# Altium project HighCurrent-Probe.PrjPcb
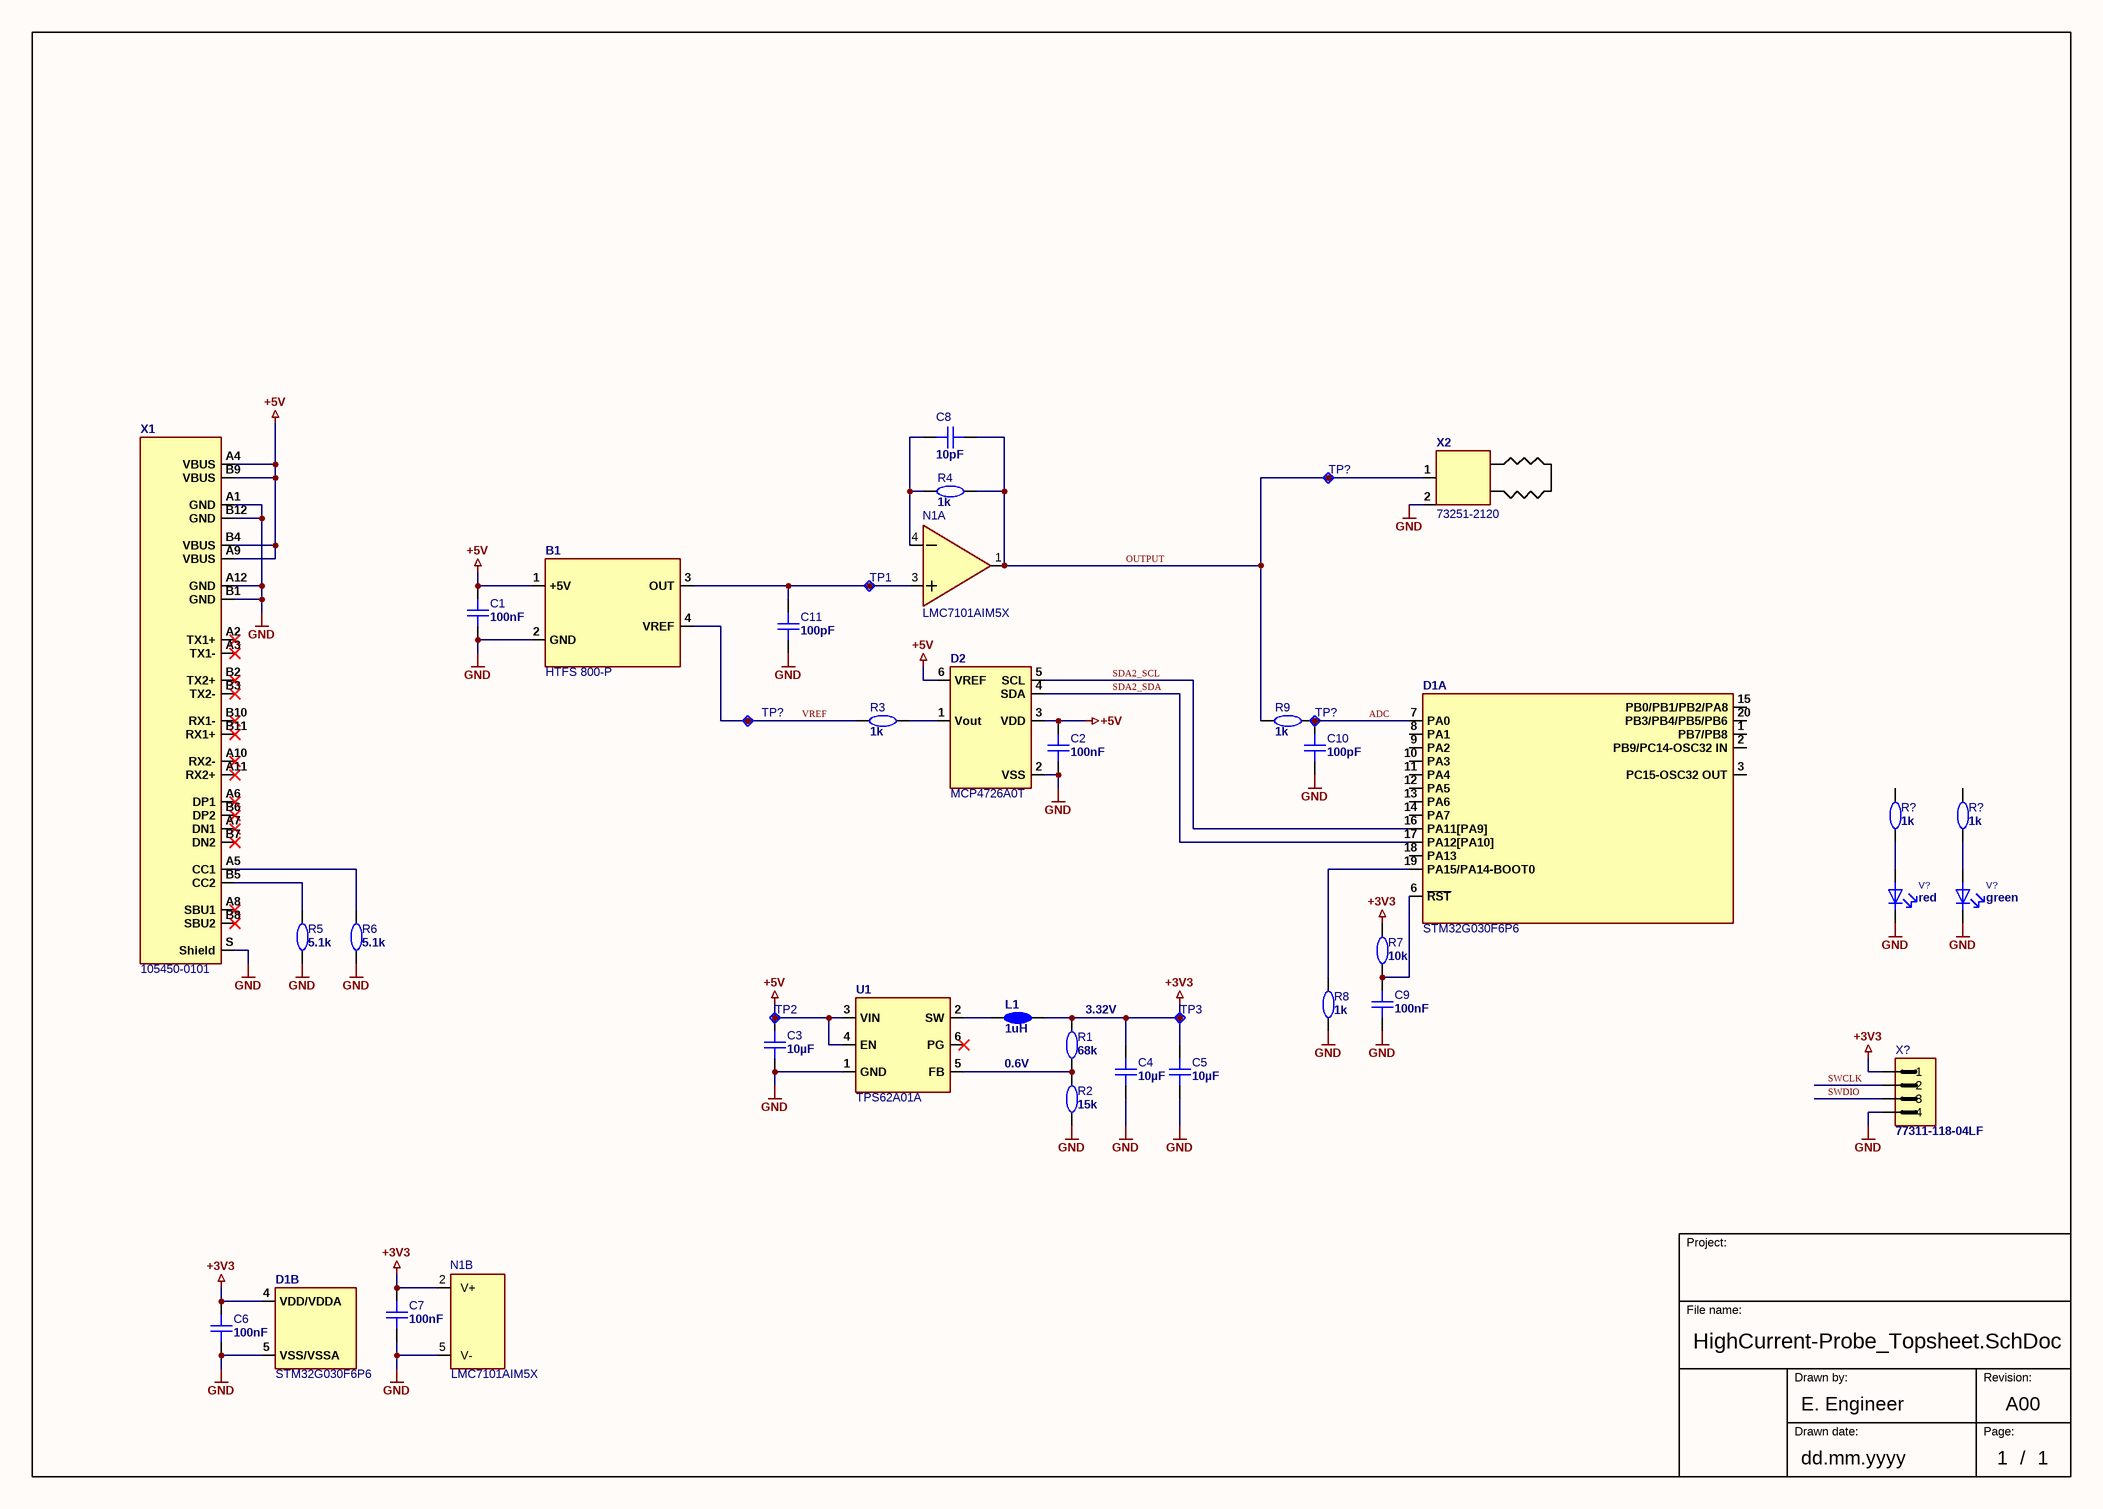
[diagram p0: HighCurrent-Probe_Topsheet.SchDoc]
PCB_Assy_DrawnBy: A. P. Assy; PCB_Assy_DrawnDate: dd.mm.yyyy; PCB_CheckedBy: C. PCB Checker; PCB_CheckedDate: dd.mm.yyyy; PCB_DrawnBy: D. Designer; PCB_DrawnDate: dd.mm.yyyy; PCB_PartNo: XXX.XXXX; PCB_PartNo: XXX.XXXX; PCB_Revision: A; PCB_Title: PCB_Title; PCB_Title: PCB_Title; PCB_TP_DocumentNo: XXXXXXXX; PCB_TP_Revision: A; Revision: A00; Schematic_CheckedBy: C. Sch Checker; Schematic_CheckedBy: C. Sch Checker; Schematic_CheckedDate: dd.mm.yyyy; Schematic_CheckedDate: dd.mm.yyyy; Schematic_DocumentNo: XXXXXXXX; Schematic_DrawnBy: E. Engineer; Schematic_DrawnBy: E. Engineer; Schematic_DrawnDate: dd.mm.yyyy; Schematic_DrawnDate: dd.mm.yyyy; Schematic_Revision: A00; Schematic_Title: SchematicTitle; Schematic_Title: SchematicTitle
1 sheet, 39 parts. Net scope: global (net labels, ports and power ports of the same name join across sheets).
Board file: HighCurrent-Probe.PcbDoc

## Sheet HighCurrent-Probe_Topsheet.SchDoc
size A3; SheetNumber: 1; SheetTotal: 1

### Parts
(Parts that share a designator on the sheet are numbered #1, #2 ... from top to bottom, then left to right.)
B1  HTFS 800-P  [HTFS 800-P]
C1  value 100nF  [C-0603_1608_095_L_RF]  (hidden comment: Cap 100n 0603)
C2  value 100nF  [C-0603_1608_095_L_RF]  (hidden comment: Cap 100n 0603)
C3  value 10µF  [C-0805_2012_155_L_RF]  (hidden comment: Cap 10u 0805)
C4  value 10µF  [C-0805_2012_155_L_RF]  (hidden comment: Cap 10u 0805)
C5  value 10µF  [C-0805_2012_155_L_RF]  (hidden comment: Cap 10u 0805)
C6  value 100nF  [C-0603_1608_095_L_RF]  (hidden comment: Cap 100n 0603)
C7  value 100nF  [C-0603_1608_095_L_RF]  (hidden comment: Cap 100n 0603)
C8  value 10pF  [C-0603_1608_095_L_RF]  (hidden comment: Cap 10p 0603)
C9  value 100nF  [C-0603_1608_095_L_RF]  (hidden comment: Cap 100n 0603)
C10  value 100pF  [C-0603_1608_095_L_RF]  (hidden comment: Cap 100p 0603)
C11  value 100pF  [C-0603_1608_095_L_RF]  (hidden comment: Cap 100p 0603)
D1  STM32G030F6P6  [TSSOP20_N_RF]  (parts A,B of 2)
D2  MCP4726A0T  [SOT23-6_N_RF]
L1  1uH  [L_0805_N_RF]
N1  LMC7101AIM5X  [SOT23-5_L_RF]  (parts A,B of 2)
R1  value 68k  [R-0603_1608_050_L_RF]  (hidden comment: Res 68k 0603)
R2  value 15k  [R-0603_1608_050_L_RF]  (hidden comment: Res 15k 0603)
R3  value 1k  [R-0603_1608_050_L_RF]  (hidden comment: Res 1k 0603)
R4  value 1k  [R-0603_1608_050_L_RF]  (hidden comment: Res 1k 0603)
R5  value 5.1k  [R-0603_1608_050_L_RF]  (hidden comment: Res 5k1 0603)
R6  value 5.1k  [R-0603_1608_050_L_RF]  (hidden comment: Res 5k1 0603)
R7  value 10k  [R-0603_1608_050_L_RF]  (hidden comment: Res 10k 0603)
R8  value 1k  [R-0603_1608_050_L_RF]  (hidden comment: Res 1k 0603)
R9  value 1k  [R-0603_1608_050_L_RF]  (hidden comment: Res 1k 0603)
R?#1  value 1k  [R-0603_1608_050_L_RF]  (hidden comment: Res 1k 0603)
R?#2  value 1k  [R-0603_1608_050_L_RF]  (hidden comment: Res 1k 0603)
TP1  TestPoint 1.0mm  [TP_1.0mm]  (value not drawn)  (no BOM)
TP2  TestPoint 1.0mm  [TP_1.0mm]  (value not drawn)  (no BOM)
TP3  TestPoint 1.0mm  [TP_1.0mm]  (value not drawn)  (no BOM)
TP?#1  TestPoint 1.0mm  [TP_1.0mm]  (value not drawn)  (no BOM)
TP?#2  TestPoint 1.0mm  [TP_1.0mm]  (value not drawn)  (no BOM)
TP?#3  TestPoint 1.0mm  [TP_1.0mm]  (value not drawn)  (no BOM)
U1  TPS62A01A  [SOT-563_N_RF]
V?#1  value red  [LED-0603_1608_Red_L_RF]  (hidden comment: LED SMD 0603 Red)
V?#2  value green  [LED-0603_1608_Green_L_RF]  (hidden comment: LED SMD 0603 Green)
X1  105450-0101  [105450-0101]
X2  73251-2120  [73251-2120]
X?  value 77311-118-04LF  [X-0101X0025_R_FCI_77311-118-04LF]  (hidden comment: CONN HEADER 4POS 1ROW THT 2.54MM)

### Nets
+3V3: C4.2 C5.2 C6.2 C7.2 D1.4(VDD/VDDA) L1.2 N1.2(V+) R1.2 R7.2 TP3.1 X?.1
+5V: B1.1(+5V) C1.2 C2.2 C3.2 D2.3(VDD) D2.6(VREF) TP2.1 U1.3(VIN) U1.4(EN) X1.A4(VBUS) X1.A9(VBUS) X1.B4(VBUS) X1.B9(VBUS)
GND: B1.2(GND) C1.1 C2.1 C3.1 C4.1 C5.1 C6.1 C7.1 C9.1 C10.1 C11.1 D1.5(VSS/VSSA) D2.2(VSS) N1.5(V-) R2.1 R5.1 R6.1 R8.1 U1.1(GND) V?#1.2 V?#2.2 X1.A1(GND) X1.A12(GND) X1.B1(GND) X1.B12(GND) X1.S(Shield) X2.2 X?.4
ADC: C10.2 D1.7(PA0) R9.2 TP?#3.1
OUTPUT: C8.2 N1.1 R4.2 R9.1 TP?#1.1 X2.1
SDA2_SCL: D1.16(PA11[PA9]) D2.5(SCL)
SDA2_SDA: D1.17(PA12[PA10]) D2.4(SDA)
SWCLK: X?.2
SWDIO: X?.3
VREF: B1.4(VREF) R3.1 TP?#2.1
NetB1_3: B1.3(OUT) C11.2 N1.3 TP1.1
NetC8_1: C8.1 N1.4 R4.1
NetC9_2: C9.2 D1.6(~{RST}) R7.1
NetD1_19: D1.19(PA15/PA14-BOOT0) R8.2
NetD2_1: D2.1(Vout) R3.2
NetL1_1: L1.1 U1.2(SW)
NetR1_1: R1.1 R2.2 U1.5(FB)
NetR5_2: R5.2 X1.B5(CC2)
NetR6_2: R6.2 X1.A5(CC1)
NetR?#1_1: R?#1.1 V?#1.1
NetR?#2_1: R?#2.1 V?#2.1

Not connected (* = marked no-connect by the designer): D1 1(PB7/PB8) 2(PB9/PC14-OSC32_IN) 3(PC15-OSC32_OUT) 8(PA1) 9(PA2) 10(PA3) 11(PA4) 12(PA5) 13(PA6) 14(PA7) 15(PB0/PB1/PB2/PA8) 18(PA13) 20(PB3/PB4/PB5/PB6); R?#1 2; R?#2 2; U1 6(PG)*; X1 A2(TX1+)* A3(TX1-)* A6(DP1)* A7(DN1)* A8(SBU1)* A10(RX2-)* A11(RX2+)* B2(TX2+)* B3(TX2-)* B6(DP2)* B7(DN2)* B8(SBU2)* B10(RX1-)* B11(RX1+)*

### Notes on the sheet
- (near R1) 3.32V
- 0.6V
- Project:
- File name:
- Drawn by:
- Revision:
- Drawn date:
- Page:
- /

### Library data of the parts
B1 = HTFS 800-P: IC Current Sensor ±1200A 5V; Part_validated: No; Manufacturer: LEM; GPV_Number: xxxx.xxxx; MNL_Number: xxxxxxxx; Value: HTFS 800-P; Footprint_validated: No; PartStatus: New; System: -; ClassName: Through-Hole_Assy; Case/Package: -; Technology: THT; Manufacturer Part Number: HTFS 800-P
C1 C2 C6 C7 C9 = CMP-001-0037-3: Cap Cer SMD 100n 50V 10% 0603 X7R; Manufacturer: KEMET; Manufacturer Part Number: C0603C104K5RAC; User: epph; Prefered: true; MNL_Number: 22310507; GPV_Number: 1749.0075; Case / Package: 0603; PartStatus: Release; Technology: SMT; ClassName: Surface_Assy
C3-C5 = CMP-00147-1: Cap Cer SMD 10u 16V 10% 0805 X7R; Manufacturer: Yageo; Manufacturer Part Number: CC0805KKX7R7BB106; Prefered: true; User: epph; GPV_Number: 1750.0364; Technology: SMT; Manufacturer Part Number 2: CL21B106KOQNNN; ClassName: Surface_Assy; Case / Package: 0805; Manufacturer 2: SAMSUNG; PartStatus: Release
C8 = CMP-001-0041-2: Cap Cer SMD 10p 50V +/- 0.25pF  0603 C0G; Manufacturer Part Number: 06035A100CAT*; Manufacturer: AVX; Prefered: true; GPV_Number: 1749.0090; User: zupa; Case / Package: 0603; ComponentLink1Description: Datasheet; ClassName: Surface_Assy; PartStatus: Release; Technology: SMT; ComponentLink1URL: https://datasheet.ciiva.com/11464/ccog-11464569.pdf
C10 C11 = CMP-001-0000-2: Cap Cer SMD 100p 50V 5% 0603 C0G; Manufacturer Part Number: CC0603J*NPO9BN101; Manufacturer: YAGEO; User: zupa; GPV_Number: 1749.0055; Prefered: false; Technology: SMT; PartStatus: Release; Case / Package: 0603; ComponentLink1Description: Datasheet; ComponentLink1URL: https://datasheet.ciiva.com/11786/0900766b8079c870-11786060.pdf; ClassName: Surface_Assy
D1 = STM32G030F6P6: IC MCU Cortex M0+ 32K Flash, 8K RAM, 64MHz; Part_validated: No; Manufacturer: ST; GPV_Number: xxxx.xxxx; MNL_Number: xxxxxxxx; Value: STM32G030F6P6; Footprint_validated: No; PartStatus: New; System: -; ClassName: Surface_Assy; Case/Package: TSSOP20; Technology: SMT; Manufacturer Part Number: STM32G030F6P6; Supplier 1: Arrow Electronics; Supplier Part Number 1: STM32G030F6P6TR
D2 = MCP4726A0T: IC DAC I2C 12Bit 2.7V-5.5V; Part_validated: No; Manufacturer: Microchip; GPV_Number: xxxx.xxxx; MNL_Number: xxxxxxxx; Value: MCP4726A0T; Footprint_validated: No; PartStatus: New; System: -; ClassName: Surface_Assy; Case/Package: SOT-23-6; Technology: SMT; Manufacturer Part Number: MCP4726A0T
L1 = MPH201210S1R0: Inductor 1uH 0.95A; Part_validated: No; Manufacturer: Sunlord; GPV_Number: xxxx.xxxx; MNL_Number: xxxxxxxx; Value: 1uH; Footprint_validated: No; PartStatus: New; System: -; ClassName: Surface_Assy; Case/Package: 0805; Technology: SMT; Manufacturer Part Number: MPH201210S1R0
N1 = CMP-001-1191-2: Low Power OP Rail to Rail; Manufacturer: Texas Instrument; Value: LM78L12ACM; User: zupa; GPV_Number: 1500.1871; Technology: SMT; ClassName: Surface_Assy; Case / Package: SOT23-5; Manufacturer Part Number: LMC7101AIM5X; PartStatus: Release
R1 = CMP-001-0280-3: Res SMD 68k 1% 0.1W 0603; Manufacturer Part Number: RC0603FR-0768KL; Manufacturer: YAGEO; GPV_Number: 1922.1473; User: zupa; Prefered: true; ClassName: Surface_Assy; PartStatus: Release; ComponentLink1URL: https://datasheet.ciiva.com/11808/0900766b80f96399-11808280.pdf; ComponentLink1Description: Datasheet; Case / Package: 0603; Technology: SMT
R2 = CMP-001-0247-3: Res SMD 15k 1% 0.1W 0603; Manufacturer: YAGEO; Manufacturer Part Number: RC0603FR-0715KL; GPV_Number: 1922.0034; Prefered: true; User: zupa; PartStatus: Release; ComponentLink1URL: https://datasheet.ciiva.com/11808/0900766b80f96399-11808280.pdf; ComponentLink1Description: Datasheet; Technology: SMT; Case / Package: 0603; ClassName: Surface_Assy
R3 R4 R8 R9 R?#1 R?#2 = CMP-001-0250-3: Res SMD 1k 1% 0.1W 0603; Manufacturer: YAGEO; Manufacturer Part Number: RC0603FR-071KL; MNL_Number: 15310012; User: zupa; GPV_Number: 1922.0011; Prefered: true; Technology: SMT; ComponentLink1Description: Datasheet; ClassName: Surface_Assy; ComponentLink1URL: https://datasheet.ciiva.com/11808/0900766b80f96399-11808280.pdf; Case / Package: 0603; PartStatus: Release
R5 R6 = CMP-001-0582-3: Res SMD 5k1 1% 0.1W 0603; Manufacturer Part Number: RC0603FR-075K1L; Manufacturer: YAGEO; Prefered: true; GPV_Number: 1922.0144; User: napa; Technology: SMT; ComponentLink1URL: https://datasheet.ciiva.com/8895/pyu-rc0603-51-rohs-l-4-8895189.pdf; PartStatus: Release; ClassName: Surface_Assy; ComponentLink1Description: Datasheet; Case / Package: 0603
R7 = CMP-001-0241-3: Res SMD 10k 1% 0.1W 0603; Manufacturer: YAGEO; Manufacturer Part Number: RC0603FR-0710KL; MNL_Number: 15310022; GPV_Number: 1922.0100; User: zupa; Prefered: true; Case / Package: 0603; ClassName: Surface_Assy; PartStatus: Release; ComponentLink1URL: https://datasheet.ciiva.com/11808/0900766b80f96399-11808280.pdf; ComponentLink1Description: Datasheet; Technology: SMT
TP1-TP3 TP?#1-TP?#3 = CMP-001-1516-3: Value: TP; User: zupa; PartStatus: Release; ClassName: Testpoint; Technology: SMT; GPV_Number: -
U1 = TPS62A01A: IC BUCK 1A 2.5-5.5Vin 2.4MHz; Manufacturer: TI; Manufacturer Part Number: TPS62A01ADRLR; CPN: 10018707-E; LPN: 1291853; Value: TPS62A01A; System: -; ClassName: Surface_Assy; Case/Package: SOT563; Technology: SMT; Supplier 1: Mouser; Supplier Part Number 1: 595-TPS62A01ADRLR
V?#1 = CMP-00078-2: LED Red LTST-C190KRKT 0603; Manufacturer: Lite-On Inc; User: epph; GPV_Number: 1602.0646; Technology: SMT; Manufacturer Part Number: LTST-C190KRKT; ClassName: Surface_Assy; Case / Package: 0603; PartStatus: Release
V?#2 = CMP-001-1208-7: LED Green LTST-C190KGKT 0603; Manufacturer: Lite-On Inc; User: epph; GPV_Number: 1602.0827; Case / Package: 0603; PartStatus: Release; Technology: SMT; ClassName: Surface_Assy; Manufacturer Part Number: LTST-C190KGKT
X1 = 105450-0101: CONN USB-C 16pin; Part_validated: No; Manufacturer: Molex; GPV_Number: xxxx.xxxx; System: Connector; MNL_Number: xxxxxxxx; Value: 105450-0101; Footprint_validated: No; PartStatus: New; ClassName: Through-Hole_Assy; Case/Package: USB-C; Technology: SMT; Manufacturer Part Number: 105450-0101
X2 = 73251-2120: CONN RF SMA; Part_validated: No; Manufacturer: MOLEX; GPV_Number: xxxx.xxxx; System: Connector; MNL_Number: xxxxxxxx; Value: 73251-2120; Footprint_validated: No; PartStatus: New; ClassName: Through-Hole_Assy; Case/Package: SMA; Technology: THT; Manufacturer Part Number: 73251-2120
X? = CMP-001-1284-4: CONN HEADER 4POS 1ROW THT 2.54MM FCI 77311-118-04LF; System: Connector; GPV_Number: 4401.2630; User: zupa; Manufacturer: FCI; Technology: THT; PartStatus: Release; ClassName: Through-Hole_Assy; Manufacturer Part Number: 77311-118-04LF; ComponentLink1URL: http://portal.fciconnect.com/Comergent//fci/drawing/77311.pdf; ComponentLink1Description: Datasheet

## Assembly variants
951.xxxx: all parts fitted